# EAGLE design BuckConverter (EAGLE 9.6.2)
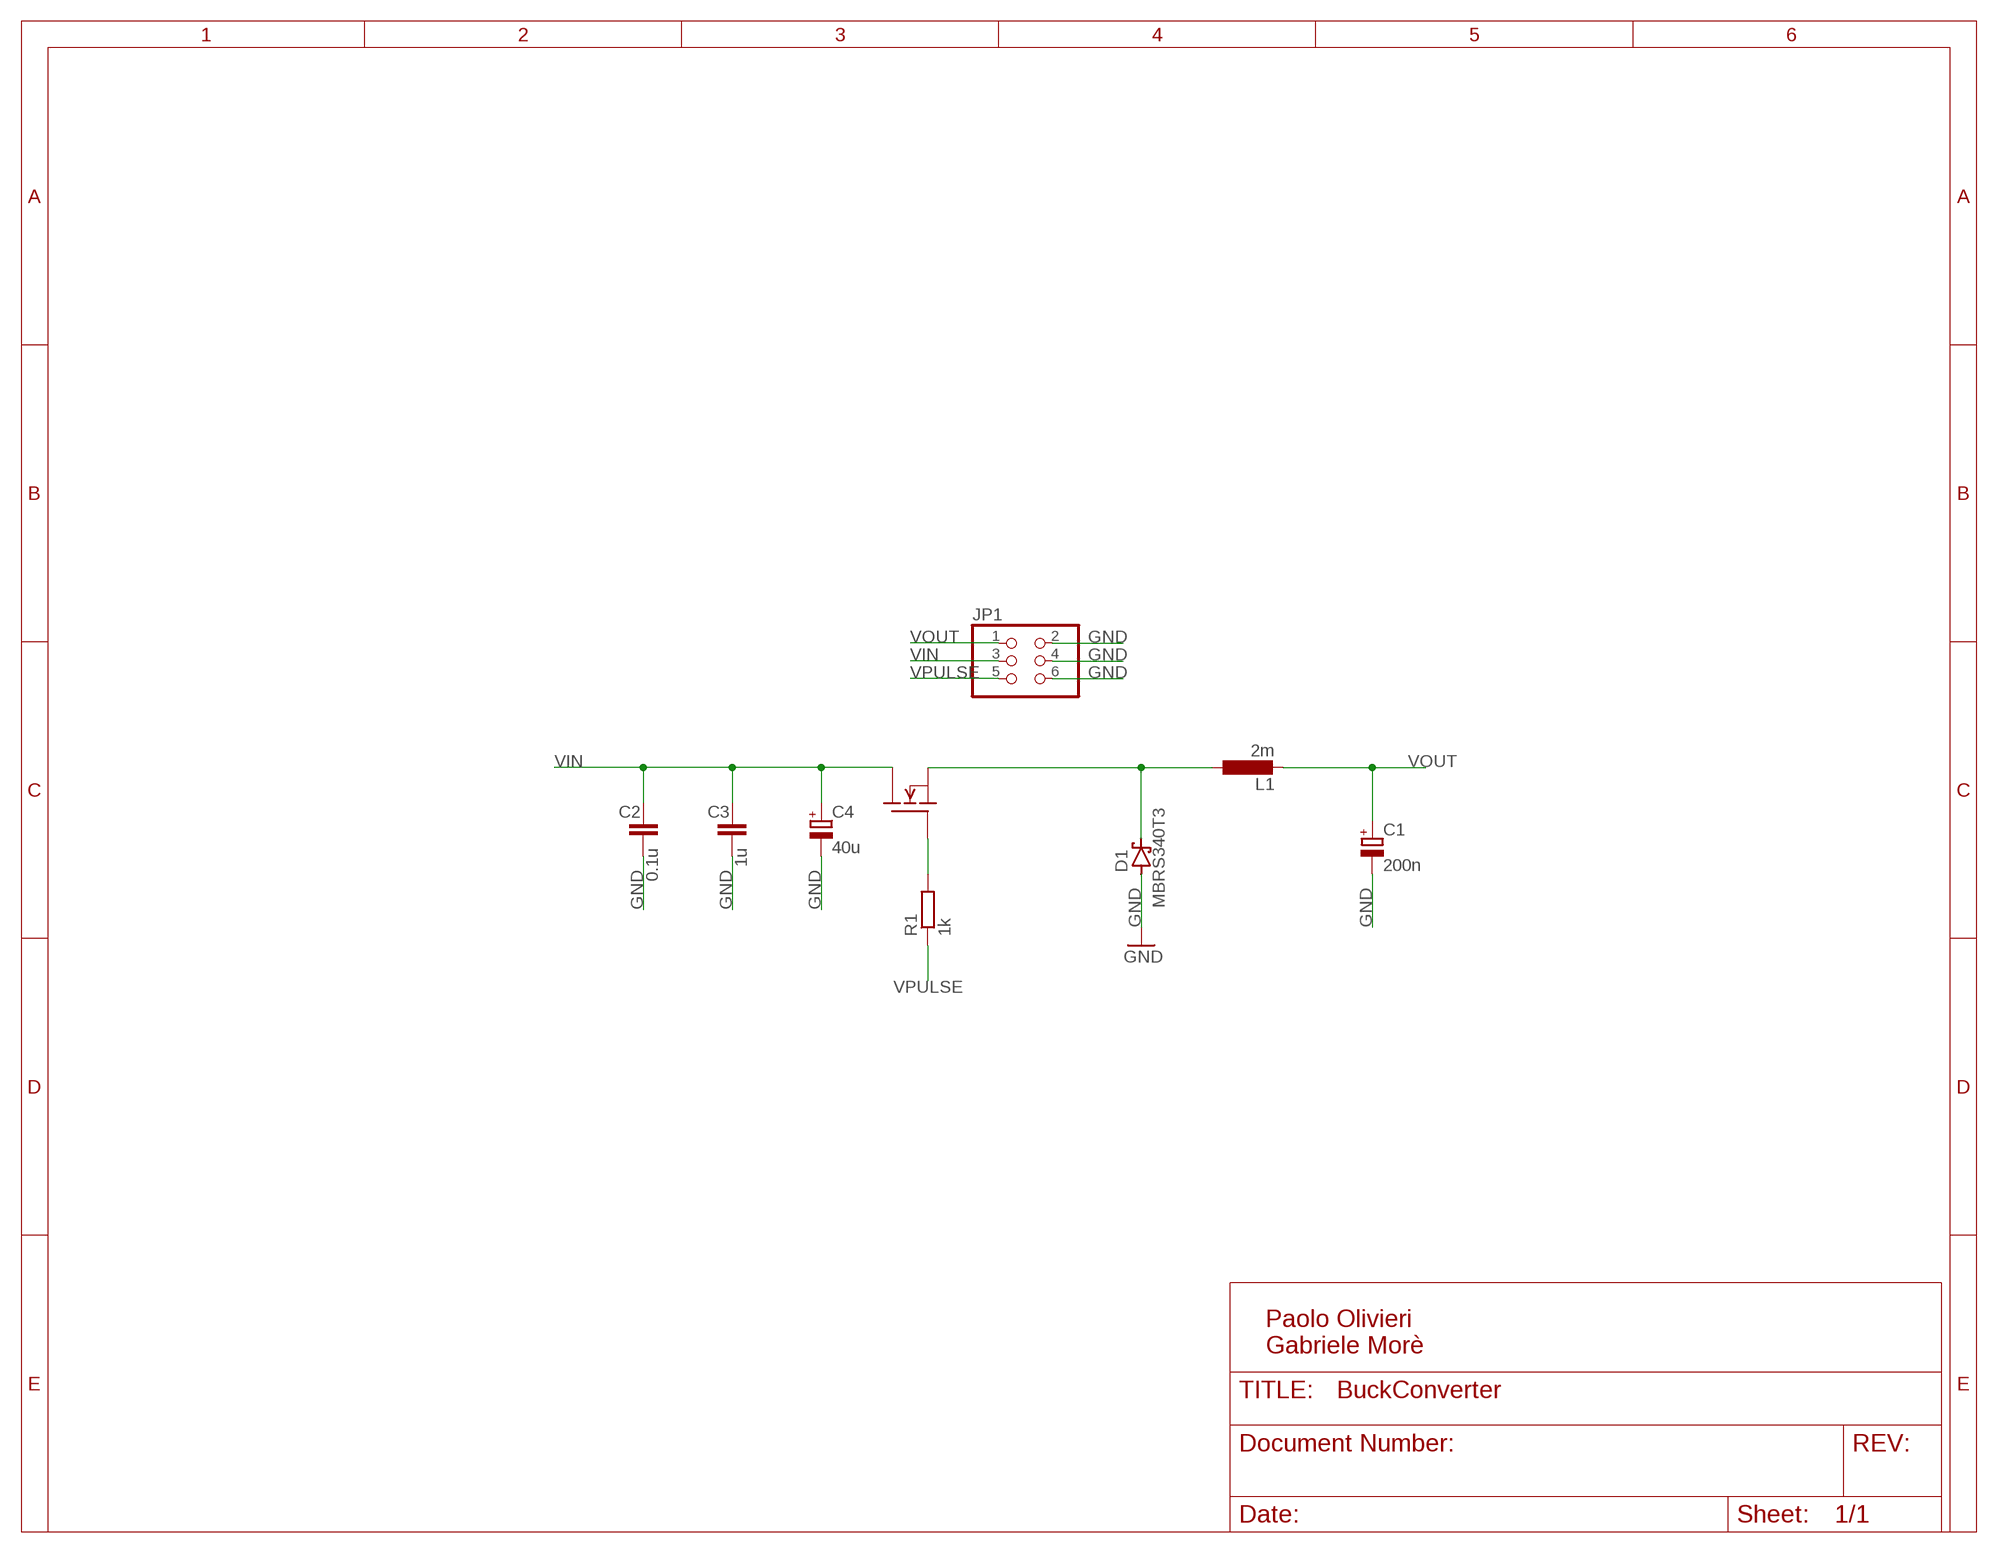
[diagram p0: schematic, sheet 1]

## Parts
C1  200n  CPOL-EUB/3528-21W  [B/3528-21W]
C2  0.1u  C-EUC0805  [C0805]
C3  1u  C-EUC0805  [C0805]
C4  40u  CPOL-EUB/3528-21W  [B/3528-21W]
D1  MBRS340T3  [SMC]
JP1  PINHD-2X3  [2X03]
L1  2m  L-EUL1812  [L1812]
Q1  IRF540  [TO220]
R1  1k  R-EU_R0805  [R0805]

## Nets
GND: C1.- C2.2 C3.2 C4.- D1.A JP1.2 JP1.4 JP1.6
N$1: D1.C L1.1 Q1.3(S)
N$3: Q1.1(G) R1.2
VIN: C2.1 C3.1 C4.+ JP1.3 Q1.2(D)
VOUT: C1.+ JP1.1 L1.2
VPULSE: JP1.5 R1.1

## Notes on the sheet
- Paolo Olivieri
  Gabriele Morè

## Library data of the parts
C1 C4 = rcl:CPOL-EU: POLARIZED CAPACITOR, European symbol; SPICEPREFIX: C
C2 C3 = rcl:C-EU: CAPACITOR, European symbol; SPICEPREFIX: C
D1 = diode:MBRS3*0T3: SCHOTTKY BARRIER RECTIFIER 3.0 AMPERES 20, 30, 40 VOLT Source: MBRS340T3-D.pdf
JP1 = pinhead:PINHD-2X3: PIN HEADER
L1 = rcl:L-EU: INDUCTOR, European symbol; SPICEPREFIX: L
Q1 = transistor-fet:IRF540: N-Channel Enhancement MOSFET (HEXFET); 100V; 28A; 0,077Ohm
R1 = rcl:R-EU_: RESISTOR, European symbol; SPICEPREFIX: R

## Board
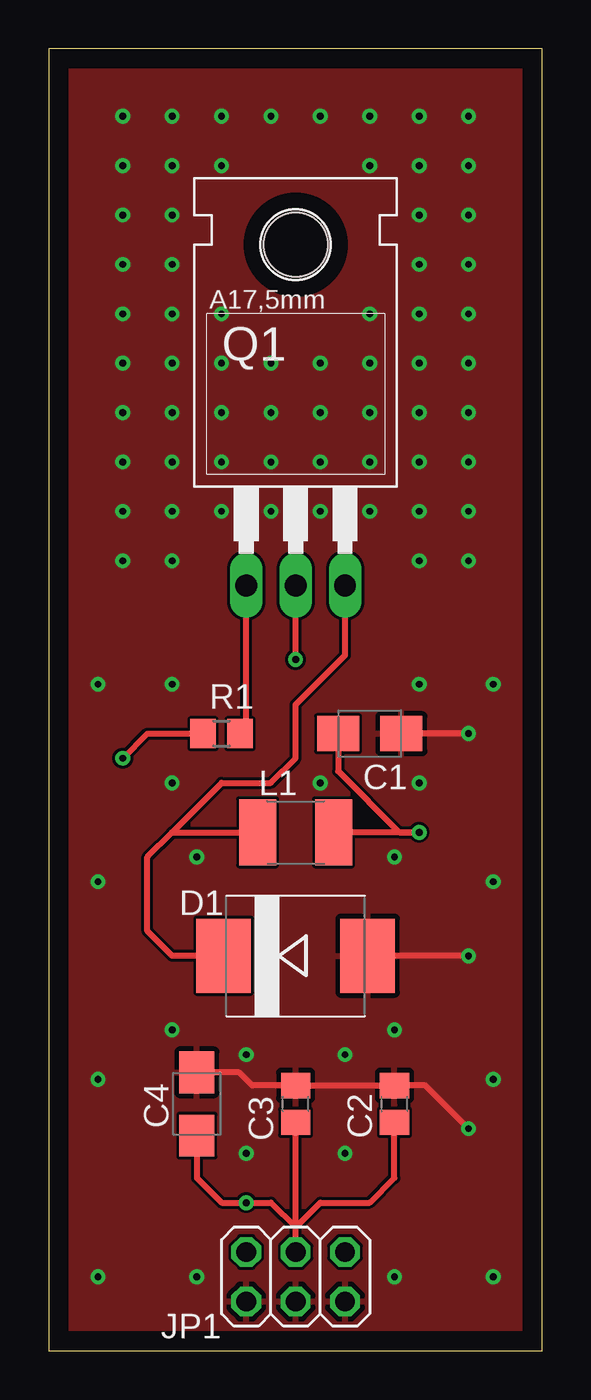
[diagram p1: board, top side]
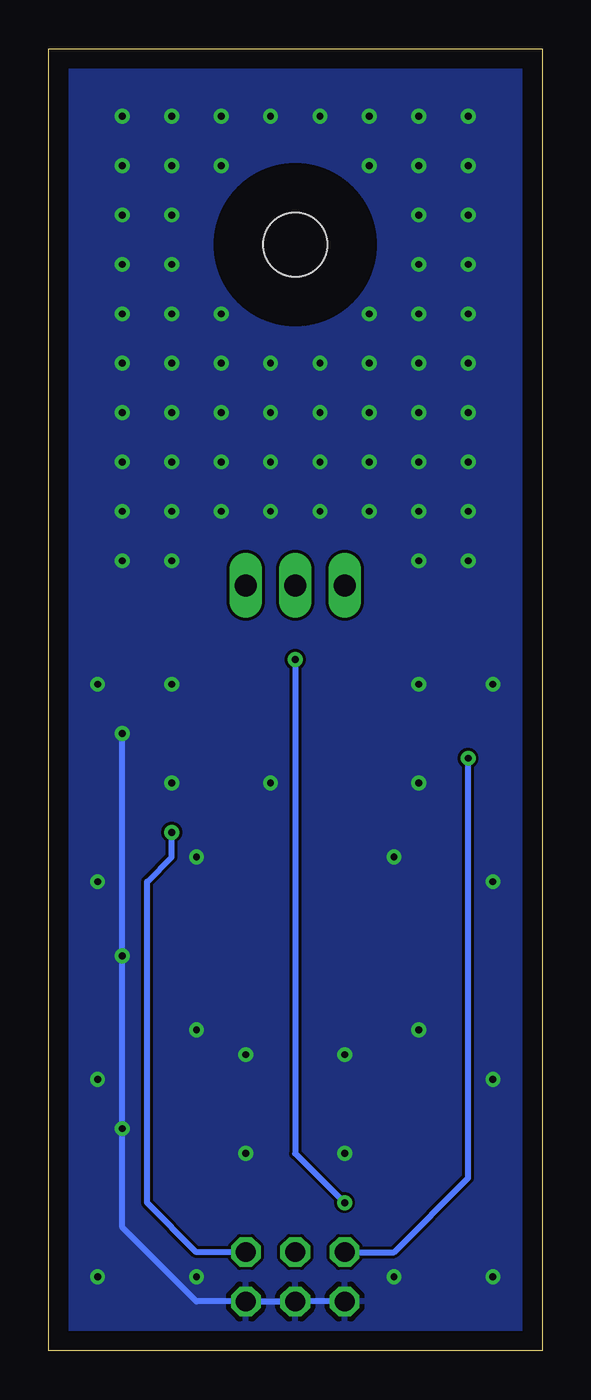
[diagram p2: board, bottom side, seen from below]

Size 25.38 x 66.98 mm. Coordinates in mm from the lower left corner, seen from the top.
Outline: 0,0 25.38,0 25.38,66.98 0,66.98 0,0
Copper layers (1*16): Top 0.035mm / dielectric 1.5mm / Bottom 0.035mm
Design rules "default": minimum track width 6mil, minimum drill 0.35mm, track to track 6mil, track to pad 6mil, pad to pad 6mil, via to via 6mil, smd to smd 6mil, copper to edge 40mil, drill to drill 6mil, minimum pad ring 10mil, minimum via ring 8mil, stop-mask expansion 4mil, vias tented up to drill 0mil, thermal gap 10mil

### Footprints (pad centres in the part's own frame; a part is rotated, then mirrored left to right if it is on the bottom)
B/3528-21W = smd 2.15 x 1.8: + 1.625,0; - -1.625,0
C0805 = smd 1.3 x 1.5: 1 -0.95,0; 2 0.95,0
SMC = smd 2.8 x 3.8: A 3.7,0; C -3.7,0
2X03 = drill 1.016 octagon: 1 -2.54,-1.27; 2 -2.54,1.27; 3 0,-1.27; 4 0,1.27; 5 2.54,-1.27; 6 2.54,1.27
L1812 = smd 1.9 x 3.4: 1 -1.95,0; 2 1.95,0
TO220 = drill 1.118 long: 1 -2.54,-6.35; 2 0,-6.35; 3 2.54,-6.35 | hole 3.302: 0,11.176
R0805 = smd 1.3 x 1.5: 1 -0.95,0; 2 0.95,0

### Placement (x,y rotation side)
C1  16.51,31.75 180 top
C2  17.78,12.7 90 top
C3  12.7,12.7 90 top
C4  7.62,12.7 270 top
D1  12.7,20.32 0 top
JP1  12.7,3.81 180 top
L1  12.7,26.67 0 top
Q1  12.7,45.72 0 top
R1  8.89,31.75 0 top

### Tracks (layer width: path | path; a pad name or v marks a point on that pad's centre or on a via)
GND  (via drill 0.35)
  Top 0.305: v21.59,11.43 19.37,13.65 C2.2 C3.2 10.48,13.65 9.8,14.32 C4.- | v21.59,20.32 D1.A | v21.59,31.75 C1.-
  Bottom 0.305: JP1.6 JP1.4 JP1.2 17.78,2.54 21.59,6.35 v21.59,11.43 v21.59,20.32 v21.59,31.75
  other vias: 2.54,34.29 6.35,34.29 6.35,29.21 2.54,24.13 7.62,25.4 19.05,34.29 22.86,34.29 19.05,29.21 13.97,29.21 17.78,25.4 22.86,24.13 17.78,16.51 15.24,15.24 10.16,15.24 6.35,16.51 2.54,13.97 10.16,10.16 15.24,10.16 22.86,13.97 22.86,3.81 17.78,3.81 7.62,3.81 2.54,3.81 6.35,40.64 3.81,40.64 3.81,43.18 6.35,43.18 6.35,45.72 3.81,45.72 3.81,63.5 6.35,63.5 8.89,63.5 11.43,63.5 13.97,63.5 16.51,63.5 19.05,63.5 21.59,63.5 21.59,60.96 19.05,60.96 16.51,60.96 8.89,60.96 6.35,60.96 3.81,60.96 3.81,58.42 6.35,58.42 6.35,55.88 3.81,55.88 3.81,53.34 6.35,53.34 6.35,50.8 3.81,50.8 3.81,48.26 6.35,48.26 8.89,53.34 8.89,50.8 8.89,48.26 11.43,50.8 8.89,45.72 8.89,43.18 11.43,43.18 11.43,45.72 11.43,48.26 13.97,48.26 13.97,50.8 13.97,45.72 13.97,43.18 16.51,43.18 19.05,43.18 19.05,40.64 21.59,40.64 21.59,43.18 21.59,45.72 19.05,45.72 16.51,45.72 16.51,48.26 19.05,48.26 21.59,48.26 21.59,50.8 19.05,50.8 16.51,50.8 19.05,58.42 21.59,58.42 21.59,55.88 19.05,55.88 16.51,53.34 19.05,53.34 21.59,53.34
  pour Top: 2.54,39.37 22.86,39.37 22.86,64.77 2.54,64.77
  pour Bottom: 2.54,39.37 22.86,39.37 22.86,64.77 2.54,64.77
  pour Bottom: 0,0 25.4,0 25.4,66.93 0,66.93
  pour Top: 0,0 25.4,0 25.4,66.93 0,66.93
N$1
  Top 0.305: D1.C 6.35,20.32 5.08,21.59 5.08,25.4 6.35,26.67 | 6.35,26.67 L1.1 | Q1.3 15.24,35.78 12.7,33.24 12.7,30.48 11.43,29.21 8.89,29.21 6.35,26.67
N$3
  Top 0.305: R1.2 10.16,32.07 Q1.1
VIN  (via drill 0.35)
  Top 0.305: 12.7,6.35 11.43,7.62 v10.16,7.62 8.89,7.62 7.62,8.89 C4.+ | C3.1 JP1.3 12.7,6.35 | 12.7,6.35 13.97,7.62 16.51,7.62 17.78,8.89 C2.1 | v12.7,35.56 Q1.2
  Bottom 0.305: v10.16,7.62 12.7,10.16 v12.7,35.56
VOUT  (via drill 0.35)
  Top 0.305: L1.2 v19.05,26.67 18.03,26.67 14.88,29.82 C1.+
  Bottom 0.305: JP1.1 17.78,5.08 20.32,7.62 20.32,24.13 19.05,25.4 v19.05,26.67
VPULSE  (via drill 0.35)
  Top 0.305: v3.81,30.48 5.08,31.75 R1.1
  Bottom 0.305: JP1.5 7.62,5.08 3.81,8.89 v3.81,30.48